# Altium project analogToCAN.PrjPcb
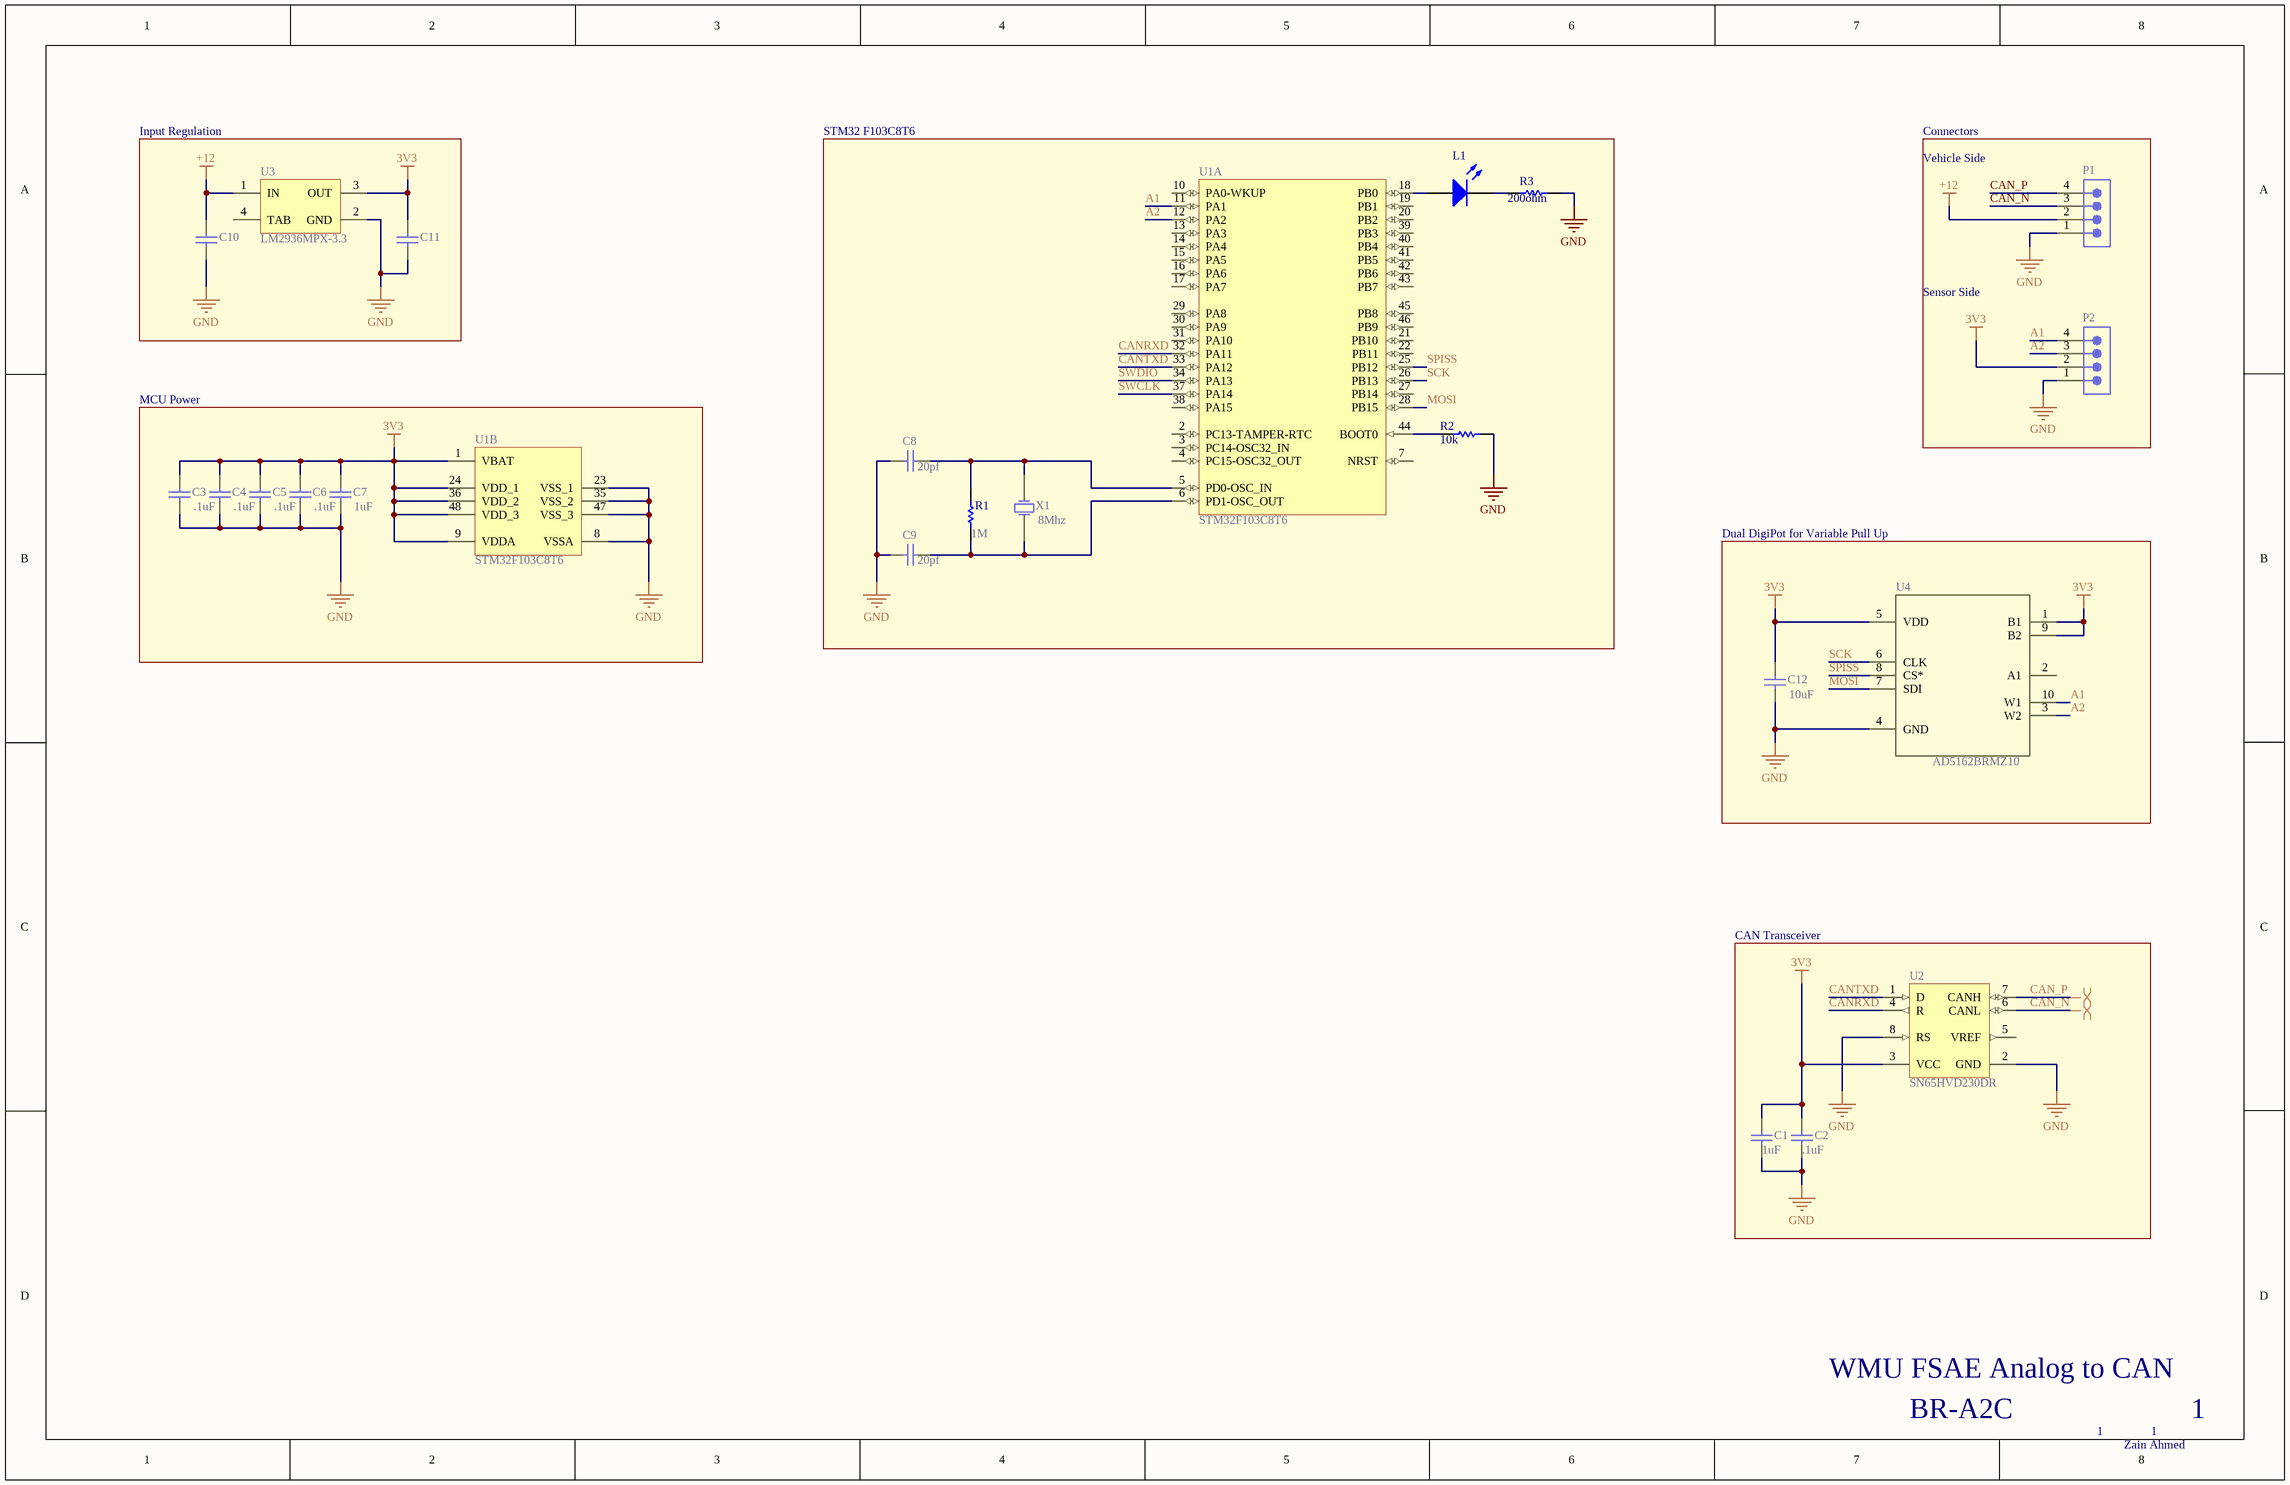
[diagram p0: mainSchematic.SchDoc]
1 sheet, 23 parts. Net scope: global (net labels, ports and power ports of the same name join across sheets).
Board file: mainPCB.PcbDoc

## Sheet mainSchematic.SchDoc
size Tabloid

### Parts
C1  GRM155R61A105KE15D  [CAPC1005X55X25NL05T10]  (value not drawn)
C2  GRM155R71C104KA88D  [CAPC1005X55X25ML05T10]  (value not drawn)
C3  GRM155R71C104KA88D  [CAPC1005X55X25ML05T10]  (value not drawn)
C4  GRM155R71C104KA88D  [CAPC1005X55X25ML05T10]  (value not drawn)
C5  GRM155R71C104KA88D  [CAPC1005X55X25ML05T10]  (value not drawn)
C6  GRM155R71C104KA88D  [CAPC1005X55X25ML05T10]  (value not drawn)
C7  GRM155R61A105KE15D  [CAPC1005X55X25NL05T10]  (value not drawn)
C8  GJM1555C1H200FB01D  [CAPC1005X55X25LL05T10]  (value not drawn)
C9  GJM1555C1H200FB01D  [CAPC1005X55X25LL05T10]  (value not drawn)
C10  08055C104KAT2A.  [CAPC2013X127X50ML20T25]  (value not drawn)
C11  GRM188R60J106ME47D  [CAPC1608X90X35NL10T15]  (value not drawn)
C12  GRM188R60J106ME47D  [CAPC1608X90X35NL10T15]  (value not drawn)
L1  150060BS75000  [0603_A]  (value not drawn)
P1  TSW-104-08-G-S  [SMTC-TSW-104-08-X-S]  (value not drawn)
P2  TSW-104-08-G-S  [SMTC-TSW-104-08-X-S]  (value not drawn)
R1  ERJ-3EKF1004V  [RESC1608X55X30LL15T15]  (value not drawn)
R2  ERJ-3EKF1002V  [RESC1608X55X30LL15T15]  (value not drawn)
R3  200R 1% 0402(1005)  [RESC0402(1005)_M]  (value not drawn)
U1  STM32F103C8T6  [STM-LQFP48_L]  (parts A,B of 2)
U2  SN65HVD230DR  [D0008A_L]
U3  LM2936MPX-3.3  [MP04A_N]
U4  AD5162BRMZ10  [*SOP50P490X110-10N]
X1  ABM3-8.000MHZ-D2Y-T  [ABRA-ABM3-2_V]  (value not drawn)

### Blocks framed on the sheet
Input Regulation: C10 C11 U3

### Nets
3V3: C1.1 C2.1 C3.1 C4.1 C5.1 C6.1 C7.1 C11.1 C12.1 P2.2 U1.1(VBAT) U1.9(VDDA) U1.24(VDD_1) U1.36(VDD_2) U1.48(VDD_3) U2.3(VCC) U3.3(OUT) U4.1(B1) U4.5(VDD) U4.9(B2)
+12: C10.1 P1.2 U3.1(IN)
GND: C1.2 C2.2 C3.2 C4.2 C5.2 C6.2 C7.2 C8.1 C9.1 C10.2 C11.2 C12.2 P1.1 P2.1 R2.2 R3.2 U1.8(VSSA) U1.23(VSS_1) U1.35(VSS_2) U1.47(VSS_3) U2.2(GND) U2.8(RS) U3.2(GND) U4.4(GND)
A1: P2.4 U1.11(PA1) U4.10(W1)
A2: P2.3 U1.12(PA2) U4.3(W2)
CAN_N: P1.3 U2.6(CANL)
CAN_P: P1.4 U2.7(CANH)
CANRXD: U1.32(PA11) U2.4(R)
CANTXD: U1.33(PA12) U2.1(D)
MOSI: U1.28(PB15) U4.7(SDI)
SCK: U1.26(PB13) U4.6(CLK)
SPISS: U1.25(PB12) U4.8(CS*)
SWCLK: U1.37(PA14)
SWDIO: U1.34(PA13)
NetC8_2: C8.2 R1.1 U1.5(PD0-OSC_IN) X1.1(X1)
NetC9_2: C9.2 R1.2 U1.6(PD1-OSC_OUT) X1.2(X2)
NetL1_1: L1.1(K) R3.1
NetL1_2: L1.2(A) U1.18(PB0)
NetR2_1: R2.1 U1.44(BOOT0)

Not connected (* = marked no-connect by the designer): U1 2(PC13-TAMPER-RTC) 3(PC14-OSC32_IN) 4(PC15-OSC32_OUT) 7(NRST) 10(PA0-WKUP) 13(PA3) 14(PA4) 15(PA5) 16(PA6) 17(PA7) 19(PB1) 20(PB2) 21(PB10) 22(PB11) 27(PB14) 29(PA8) 30(PA9) 31(PA10) 38(PA15) 39(PB3) 40(PB4) 41(PB5) 42(PB6) 43(PB7) 45(PB8) 46(PB9); U2 5(VREF); U3 4(TAB); U4 2(A1)

### Layout directives
differential pair: CAN_N, CAN_P

### Notes on the sheet
- STM32 F103C8T6
- Connectors
- Vehicle Side
- (near R3) 200ohm
- Sensor Side
- MCU Power
- (near C8) 20pf
- (near R2) 10k
- (near C4) .1uF
- (near C5) .1uF
- (near C6) .1uF
- (near C7) .1uF
- (near C7) 1uF
- (near C9) 20pf
- (near R1) 1M
- (near X1) 8Mhz
- Dual DigiPot for Variable Pull Up
- (near C12) 10uF
- CAN Transceiver
- (near C1) 1uF
- (near C2) .1uF
- WMU FSAE Analog to CAN
- BR-A2C
- 1
- Zain Ahmed

### Library data of the parts
C1 C7 = CMP-2008-04556-1: Manufacturer: Murata; Part Number: GRM155R61A105KE15D
C2-C6 = CMP-2100-03641-1: Chip Capacitor, 0.1 uF, +/- 10%, 16 V, -55 to 125 degC, 0402 (1005 Metric), RoHS, Tape and Reel; Manufacturer: Murata; Material: Ceramic; Insulation Resistance: 10GR; Voltage: 16V; Dielectric: X7R; Capacitance: 100nF; REACH SVHC: NoSVHC; Depth: 0.5mm; Case/Package: 0402; Datasheet URL: http://psearch.en.murata.com/capacitor/product/GRM155R71C104KA88%23.pdf; Lead Free: LeadFree; Dielectric Material: Ceramic; Manufacturer URL: http://www.murata.com/; Min Operating Temperature: -55degC; Length: 1mm; Case Code (Metric): 1005; Radiation Hardening: No; Package Reference: 0402; RoHSCompliant: true; Datasheet Version: 42675.0; Thickness: 0.022inch; Packaging: TapeandReel; Voltage Rating (DC): 16V; Tolerance: 10%; Max Operating Temperature: 125degC; Package Description: 2-Pin Surface Mount Device, Body 1 x 0.5 mm; Mount: SurfaceMount; Height: 0.5mm; Width: 0.5mm; Number of Pins: 2; Voltage Rating: 16V; Case Code (Imperial): 0402; Termination: SMD/SMT; Package Quantity: 1
C8 C9 = CMP-2008-03775-1: Manufacturer: Murata; Part Number: GJM1555C1H200FB01D
C10 = CMP-2007-04840-1: Manufacturer: AVX Interconnect / Elco; Part Number: 08055C104KAT2A.
C11 C12 = CMP-2006-02792-1: Manufacturer: Murata; Part Number: GRM188R60J106ME47D
L1 = CMP-1426-00003-1: SMD mono-color Chip LED, WL-SMCW, Blue; Manufacturer: Wuerth Elektronik; Color: Blue; ComponentLink2Description: Datasheet; ComponentLink2URL: http://katalog.we-online.com/led/datasheet/150060BS75000.pdf; ComponentLink1URL: http://www.we-online.com; PackageReference: 0603_A; PartNumber: 150060BS75000; ComponentLink1Description: Manufacturer URL
P1 P2 = CMP-1024-00357-1: 0.025" SQ Post Header, Through-hole, Vertical, -55 to 125 degC, 2.54 mm Pitch, 4-Pin, Male, RoHS; Manufacturer: Samtec; Pitch: 2.54 mm; RoHS: True; ComponentLink3URL: http://www.samtec.com/documents/webfiles/cpdf/TSW-XXX-XX-XXX-X-XX-XXX-MKT.pdf; Mounting Technology: Through-hole; ComponentLink2URL: http://www.samtec.com/documents/webfiles/pdf/TSW_TH.PDF; ComponentLink1URL: http://www.samtec.com; ComponentLink3Description: Package Specification; PackageVersion: DM, 8/1988; ComponentLink2Description: Datasheet; PackageReference: TSW-104-08-X-S; PackageDescription: .025[0.64] SQ. Post Terminal Strip Assembly; PartNumber: TSW-104-08-G-S; ComponentLink1Description: Manufacturer URL; Temperature Range: -55 to 125 degC; DatasheetVersion: F-214; Orientation: Vertical
R1 = CMP-2000-00183-1: Manufacturer: Panasonic; Part Number: ERJ-3EKF1004V
R2 = CMP-2000-00181-1: Manufacturer: Panasonic; Part Number: ERJ-3EKF1002V
R3 = CMP-1011-00429-1: 200R 0.063W 1% 0402 (1005 Metric)  SMD; Case-Metric: 1005; Value: 200.00 Ohm; Case-EIA: 0402; Technology: SMT; Tolerance: 1 %; Power: 0.063 W
U1 = CMP-0237-00215-3: ARM Cortex-M3 32-bit MCU, 64 KB Flash, 20 KB Internal RAM, 37 I/Os, 48-pin LQFP, -40 to 85 degC, Tray; Supply Voltage(Vcc) min (V): 2; Internal RAM Size (kB): 20; FLASH Size (Prog) (kB): 64; A/D Converter: 2x12-bit (10 Channel); I/Os (High Current): 37; Operating Frequency(F) (Processor speed) (MHz): 72; Core: ARM Cortex-M3; ComponentLink3Description: Package Specification; Mounting Technology: Surface Mount; PartNumber: STM32F103C8T6; PackageReference: LQFP48; Packing: Tray; ComponentLink3URL: http://www.st.com/st-web-ui/static/active/en/resource/technical/document/datasheet/DM00058181.pdf; DatasheetVersion: Rev. 16; ComponentLink1URL: http://www.st.com/web/en/home.html; PackageVersion: Rev. 6, 06/2013; ComponentLink2URL: http://www.st.com/st-web-ui/static/active/en/resource/technical/document/datasheet/CD00161566.pdf; ComponentLink1Description: Manufacturer URL; ComponentLink2Description: Datasheet; PackageDescription: 48-Pin Low Profile Quad Flat Package, 7 x 7 mm Body, 0.5 mm Pitch
U2 = CMP-0315-00015-2: 3.3V CAN Transceiver with Standby Mode, 17 mA, -40 to 85 degC, 8-pin SOIC (D), Green (RoHS & no Sb/Br); Manufacturer: Texas Instruments; Rating: Catalog; Transient Pulse Protection(V): -25 to 25; Receivers Per Package: 1; ICC(Max)(mA): 17; Supply Voltage(s)(V): 3.3; Low Power Mode: Standby; Mounting Technology: Surface Mount; PackageReference: D0008A; Footprint: PCA82C250; ComponentLink1URL: http://www.ti.com/general/docs/lit/getliterature.tsp?genericPartNumber=SN65HVD230&fileType=pdf; Code_JEDEC: MS-012AA; ComponentLink1Description: Datasheet; Eco-Plan: Green (RoHS & no Sb/Br); PartNumber: SN65HVD230DR; PackageDescription: 8-Pin Plastic Small Outline Integrated Circuit, 4.9 x 3.9 mm, Pitch 1.27 mm Pitch; Isolated: No; DatasheetVersion: SLOS346K; PackageVersion: revM, Jun-2011; SubFamily: CAN; Drivers Per Package: 1
U3 = CMP-0062-01666-2: Ultra-Low Quiescent Current LDO Voltage Regulator, 4-pin SOT-223; Manufacturer: National Semiconductor; PackageTopMarking: XYTT*KABA; CompType: LDO IC; PowerWise: N; ComponentLink3URL: http://www.national.com/packaging/folders/mp04a.html; PackageVersion: revB, Apr-2003; ComponentLink2URL: http://www.national.com/pf/LM/LM2936.html; ComponentLink3Description: MP04A Package Page; PinCount: 4; Code_IPC: SOT223-4; RevisionNote: Component URLs added; ComponentLink2Description: LM2936 Web Page; Code_JEDEC: TO-261-AA; PackageReference: MP04A; PackageDescription: Molded SOT-223, 6.50 x 3.56 x 1.6mm Body, 4 Lead, 2.3mm Pitch; ComponentLink1URL: http://www.national.com/ds/LM/LM2936.pdf; DatasheetVersion: Oct-2006; RoHS: N; ComponentLink1Description: LM2936 Datasheet
U4 = AD5162BRMZ10: Digital Potentiometer, Volatile, 10kohm, 256, Dual, Msop-10; MF: Analog Devices; SnapEDA_Link: https://www.snapeda.com/parts/AD5162BRMZ10/Analog%20Devices%20Inc./view-part/?ref=snap; Availability: Unavailable; MP: AD5162BRMZ10; Price: None; Package: MSOP-10 Analog Devices; Value: *
X1 = CMP-2000-05033-1: Miniature Ceramic Crystal, 8 MHz, -40 to 85 degC, 2-Pin SMD, RoHS, Tape and Reel; Manufacturer: ABRACON; Case Length: 5mm; Case Width: 3.2mm; Case Height: 1.3mm; Load Capacitance: 18pF; Frequency: 8MHz; Frequency Stability: 30PPM; ESR: 140Ohms; Tolerance: 20PPM; Type: MiniatureCeramicCrystal; Factory Pack Quantity: 1000; Package / Case: 5mmx3.2mm; Mounting Style: SMD/SMT; Manufacturer URL: http://www.abracon.com/; RoHS: Details; Dimensions: 3.2mmWx5mmLx1.3mmH; Datasheet URL: http://www.farnell.com/datasheets/1754353.pdf; Brand: ABRACON; Packaging: Reel; Product Category: Crystals; Package Description: 2-Pin Surface Mount Device, Body 5 x 3.2 mm; Package URL: http://www.abracon.com/Support/PackageDrawing/Resonators/ABM3.PDF; Operating Temperature Range: -40Cto+85C; Termination Style: SMD/SMT; Datasheet Version: Sep-13; Series: ABM3; Package Reference: ABM3-2